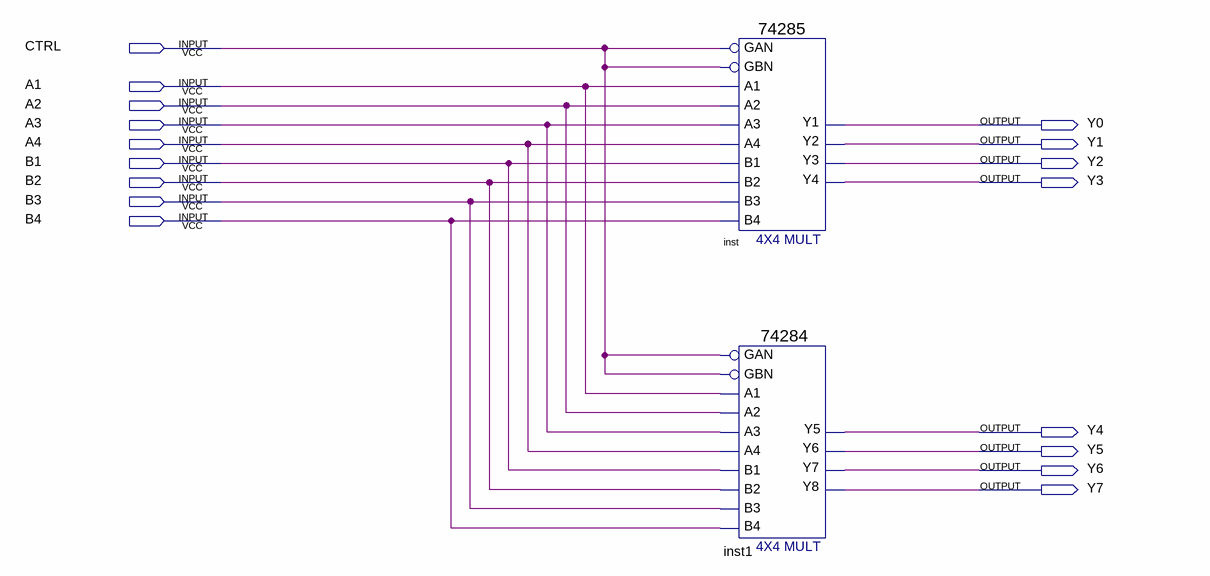
[diagram p0: schematic sheet]
// Quartus schematic MUL.bdf as structural Verilog: 2 symbols, 17 pins
module MUL (
  input  CTRL,
  input  A1,
  input  A2,
  input  A3,
  input  A4,
  input  B1,
  input  B2,
  input  B3,
  input  B4,
  output Y0,
  output Y1,
  output Y2,
  output Y3,
  output Y4,
  output Y5,
  output Y6,
  output Y7
);

  \74285  inst (
    .GBN(CTRL), .GAN(CTRL), .A1(A1), .A2(A2), .A3(A3), .B2(B2), .B1(B1), .A4(A4), .B4(B4), .B3(B3), .Y4(Y3),
    .Y1(Y0), .Y2(Y1), .Y3(Y2));
  \74284  inst1 (
    .GAN(CTRL), .A2(A2), .A1(A1), .GBN(CTRL), .B1(B1), .A4(A4), .A3(A3), .B4(B4), .B3(B3), .B2(B2), .Y8(Y7),
    .Y6(Y5), .Y7(Y6), .Y5(Y4));
endmodule
